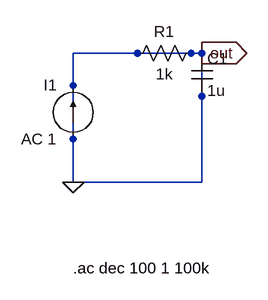
[diagram p0: schematic test_rc_lowpass.asc]
test_rc_lowpass.asc, the LTspice schematic file:
Version 4
SHEET 1 1600 680
WIRE 0 192 0 384
WIRE 0 192 128 192
WIRE 128 192 192 192
WIRE 192 192 192 256
WIRE 192 256 192 384
WIRE 192 384 0 384
FLAG 0 384 0
FLAG 192 192 out
IOPIN 192 192 Out
SYMBOL current 0 320 R180
WINDOW 0 24 80 Left 2
WINDOW 3 24 0 Left 2
SYMATTR InstName I1
SYMATTR Value AC 1
SYMBOL res 192 176 R90
WINDOW 0 0 56 VBottom 2
WINDOW 3 32 56 VTop 2
SYMATTR InstName R1
SYMATTR Value 1k
SYMBOL cap 176 192 R0
SYMATTR InstName C1
SYMATTR Value 1u
TEXT 0 512 Left 2 !.ac dec 100 1 100k

The netlist it stands for:
* test_rc_lowpass.asc
I1 0 0 AC 1
R1 0 0 1k
C1 0 0 1u
.ac dec 100 1 100k
.backanno
.end